# Altium project SPNEX_Payload.PrjPcb (part 1 of 3)
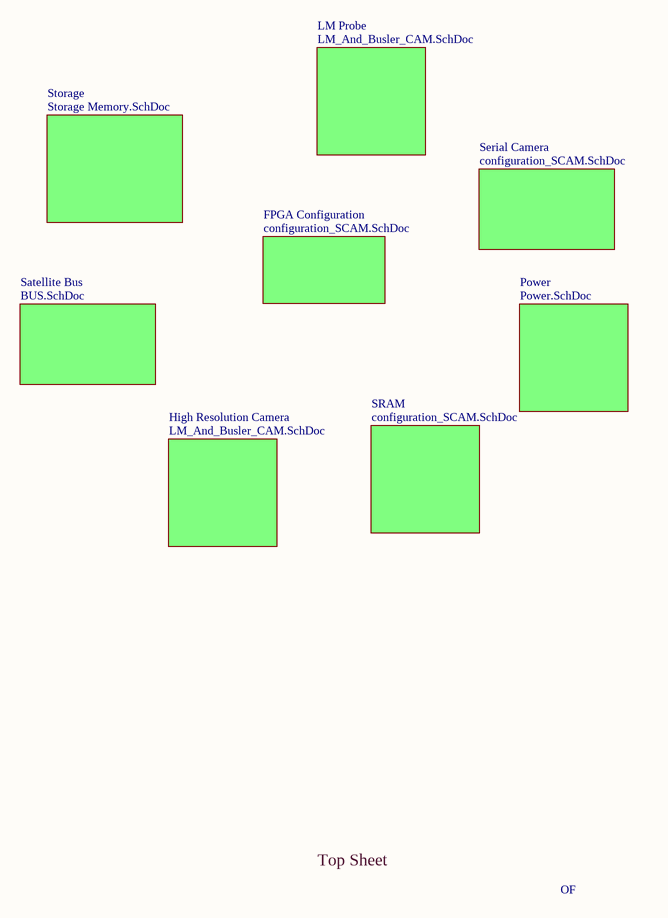
[diagram p0: Topsheet.SchDoc]
myproject: SPNEX  Payload
6 sheets, 308 parts. Net scope: global (net labels, ports and power ports of the same name join across sheets).
Board file: SPNEX_PAYLOAD_new.PcbDoc
Sheets:
  Topsheet.SchDoc
    FPGA Configuration = configuration_SCAM.SchDoc
    Power = Power.SchDoc
    LM Probe = LM_And_Busler_CAM.SchDoc
    Storage = Storage Memory.SchDoc
    Serial Camera = configuration_SCAM.SchDoc
    Satellite Bus = BUS.SchDoc
    High Resolution Camera = LM_And_Busler_CAM.SchDoc
    SRAM = configuration_SCAM.SchDoc

## Sheet Topsheet.SchDoc
size A4; SheetNumber: 1; SheetTotal: 6

### Sub-sheets
FPGA Configuration = configuration_SCAM.SchDoc: no entries
High Resolution Camera = LM_And_Busler_CAM.SchDoc: no entries
LM Probe = LM_And_Busler_CAM.SchDoc: no entries
Power = Power.SchDoc: no entries
Satellite Bus = BUS.SchDoc: no entries
Serial Camera = configuration_SCAM.SchDoc: no entries
SRAM = configuration_SCAM.SchDoc: no entries
Storage = Storage Memory.SchDoc: no entries

### Notes on the sheet
- Top Sheet
- OF

## Sheet configuration_SCAM.SchDoc
size A3; SheetNumber: 4; SheetTotal: 6
Used 3 times, as channels FPGA Configuration, Serial Camera, SRAM. Parts and nets are listed once, with the designators drawn on the sheet.
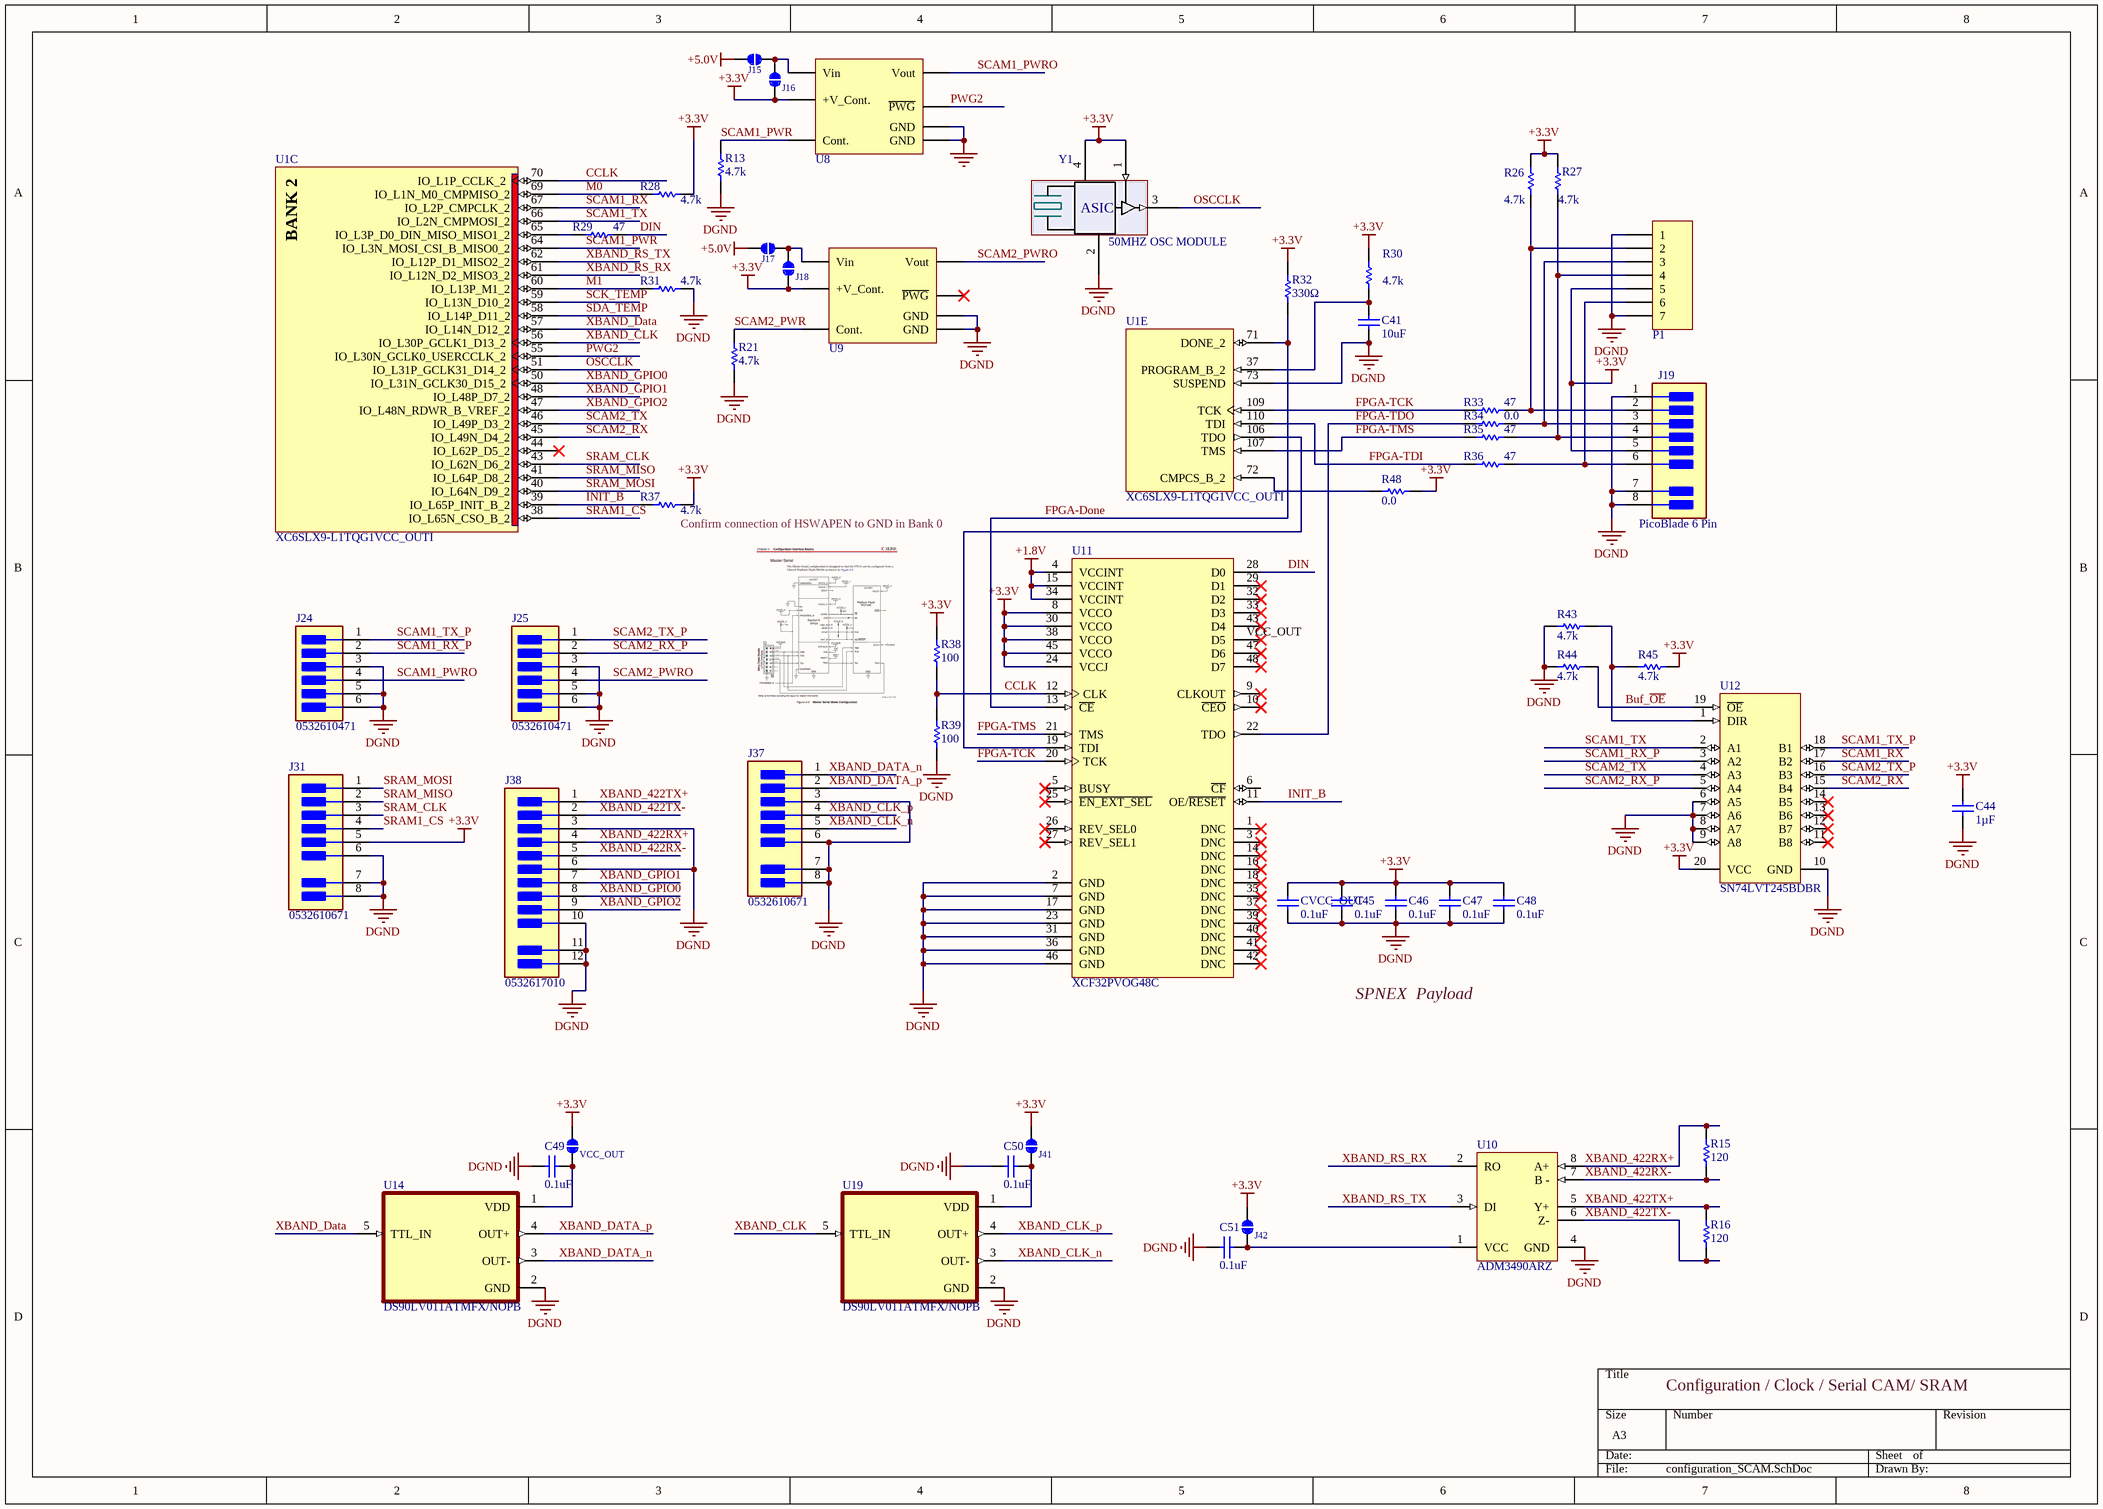
[diagram p1: configuration_SCAM.SchDoc]

### Parts
C41  value 10uF  [capc3216n]  (hidden comment: Cap Semi)
C44  Capacitance: 1µF  [0603CAP]  (hidden comment: Cap_CER_1U_10V_0603)
C45  0.1uF  [0805CAP]
C46  0.1uF  [0805CAP]
C47  0.1uF  [0805CAP]
C48  0.1uF  [0805CAP]
C49  0.1uF  [0805CAP]
C50  value 0.1uF  [0805 - CAP]  (hidden comment: Cap_CER_0.1U_16V_0805)
C51  value 0.1uF  [0805 - CAP]  (hidden comment: Cap_CER_0.1U_16V_0805)
CVCC_OUT  0.1uF  [0805CAP]
J15  JUMPER  [SJMP]  (value not drawn)
J16  JUMPER  [SJMP]  (value not drawn)
J17  JUMPER  [SJMP]  (value not drawn)
J18  JUMPER  [SJMP]  (value not drawn)
J19  PicoBlade 6 Pin  [Molex_6RA_MFG]
J24  0532610471  [Molex_4RA_MFG]
J25  0532610471  [Molex_4RA_MFG]
J31  0532610671  [Molex_6RA_MFG]
J37  0532610671  [Molex_6RA_MFG]
J38  0532617010  [Molex_10RA]
J41  JUMPER  [SJMP]  (value not drawn)
J42  JUMPER  [SJMP]  (value not drawn)
P1  Header 7  [HDR1X7F]  (value not drawn)
R13  Resistance (Ohms): 4.7k  [0603RES]  (hidden comment: RES_4.7K_0.1W_0603)
R15  Resistance (Ohms): 120  [0603RES]  (hidden comment: RES_120_0.25W_0603)
R16  Resistance (Ohms): 120  [0603RES]  (hidden comment: RES_120_0.25W_0603)
R21  Resistance (Ohms): 4.7k  [0603RES]  (hidden comment: RES_4.7K_0.1W_0603)
R26  Resistance (Ohms): 4.7k  [0603RES]  (hidden comment: RES_4.7K_0.1W_0603)
R27  Resistance (Ohms): 4.7k  [0603RES]  (hidden comment: RES_4.7K_0.1W_0603)
R28  Resistance (Ohms): 4.7k  [0603RES]  (hidden comment: RES_4.7K_0.1W_0603)
R29  Resistance (Ohms): 47  [0603RES]  (hidden comment: RES_47R_0.25W_0805)
R30  Resistance (Ohms): 4.7k  [0603RES]  (hidden comment: RES_4.7K_0.1W_0603)
R31  Resistance (Ohms): 4.7k  [0603RES]  (hidden comment: RES_4.7K_0.1W_0603)
R32  Resistance: 330Ω  [0603]  (hidden comment: RES_330 Ohm_0603)
R33  Resistance (Ohms): 47  [0603RES]  (hidden comment: RES_47R_0.25W_0805)
R34  Resistance (Ohms): 0.0  [0603RES]  (hidden comment: RES_0_0.1W_0603)
R35  Resistance (Ohms): 47  [0603RES]  (hidden comment: RES_47R_0.25W_0805)
R36  Resistance (Ohms): 47  [0603RES]  (hidden comment: RES_47R_0.25W_0805)
R37  Resistance (Ohms): 4.7k  [0603RES]  (hidden comment: RES_4.7K_0.1W_0603)
R38  Resistance (Ohms): 100  [0603RES]  (hidden comment: RES_100_0.1W_0603)
R39  Resistance (Ohms): 100  [0603RES]  (hidden comment: RES_100_0.1W_0603)
R43  Resistance (Ohms): 4.7k  [0603RES]  (hidden comment: RES_4.7K_0.1W_0603)
R44  Resistance (Ohms): 4.7k  [0603RES]  (hidden comment: RES_4.7K_0.1W_0603)
R45  Resistance (Ohms): 4.7k  [0603RES]  (hidden comment: RES_4.7K_0.1W_0603)
R48  Resistance (Ohms): 0.0  [0603RES]  (hidden comment: RES_0_0.1W_0603)
U1  XC6SLX9-L1TQG1VCC_OUTI  [TQG144_M]  (parts C,E of 7)
U8  LTC3461 module  [OCPfootprint]  (value not drawn)
U9  LTC3461 module  [OCPfootprint]  (value not drawn)
U10  ADM3490ARZ  [Soic8_IPCA]
U11  XCF32PVOG48C  [VOG48]
U12  SN74LVT245BDBR  [DB0020A_M]
U14  DS90LV011ATMFX/NOPB  [SOT95P280X145-5N]
U19  DS90LV011ATMFX/NOPB  [SOT95P280X145-5N]
VCC_OUT  JUMPER  [SJMP]  (value not drawn)
Y1  50MHZ OSC MODULE  [OscModule]

### Nets
+1.8V: U11.4(VCCINT) U11.15(VCCINT) U11.34(VCCINT)
+3.3V: C44.2 C45.2 C46.2 C47.2 C48.2 CVCC_OUT.2 J16.1 J18.1 J19.5 J31.5 J41.2 J42.2 P1.5 R26.2 R27.2 R28.1 R30.2 R32.2 R37.1 R38.2 R45.1 R48.2 U8.5(+V_Cont.) U9.5(+V_Cont.) U11.8(VCCO) U11.24(VCCJ) U11.30(VCCO) U11.38(VCCO) U11.45(VCCO) U12.20(VCC) VCC_OUT.2 Y1.1(E/D) Y1.4(VDD)
+5.0V: J15.2 J17.2
DGND: C41.1 C44.1 C45.1 C46.1 C47.1 C48.1 C49.2 C50.1 C51.1 CVCC_OUT.1 J19.1 J19.7 J19.8 J24.3 J24.5 J24.6 J25.3 J25.5 J25.6 J31.6 J31.7 J31.8 J37.3 J37.6 J37.7 J37.8 J38.3 J38.6 J38.10 J38.11 J38.12 P1.1 P1.7 R13.2 R21.2 R31.1 R39.1 R43.2 R44.2 U1.73(SUSPEND) U8.2(GND) U8.4(GND) U9.2(GND) U9.4(GND) U10.4(GND) U11.2(GND) U11.7(GND) U11.17(GND) U11.23(GND) U11.31(GND) U11.36(GND) U11.46(GND) U12.6(A5) U12.7(A6) U12.8(A7) U12.9(A8) U12.10(GND) U14.2(GND) U19.2(GND) Y1.2(GND)
Buf_~{OE}: R44.1 U12.19(~{OE})
CCLK: R38.1 R39.2 U1.70(IO_L1P_CCLK_2) U11.12(CLK)
DIN: R29.2 U11.28(D0)
FPGA-Done: R32.1 U1.71(DONE_2) U11.13(~{CE})
FPGA-TCK: R33.1 U1.109(TCK) U11.20(TCK)
FPGA-TDI: R36.1 U1.110(TDI)
FPGA-TDO: R34.1 U11.22(TDO)
FPGA-TMS: R35.1 U1.107(TMS) U11.21(TMS)
INIT_B: R37.2 U1.39(IO_L65P_INIT_B_2) U11.11(OE/~{RESET})
M0: R28.2 U1.69(IO_L1N_M0_CMPMISO_2)
M1: R31.2 U1.60(IO_L13P_M1_2)
OSCCLK: U1.51(IO_L31P_GCLK31_D14_2) Y1.3(Output)
PWG2: U1.55(IO_L30N_GCLK0_USERCCLK_2) U8.7(~{PWG})
SCAM1_PWR: R13.1 U1.64(IO_L3N_MOSI_CSI_B_MISO0_2) U8.6(Cont.)
SCAM1_PWRO: J24.4 U8.3(Vout)
SCAM1_RX: U1.67(IO_L2P_CMPCLK_2) U12.17(B2)
SCAM1_RX_P: J24.2 U12.3(A2)
SCAM1_TX: U1.66(IO_L2N_CMPMOSI_2) U12.2(A1)
SCAM1_TX_P: J24.1 U12.18(B1)
SCAM2_PWR: R21.1 U9.6(Cont.)
SCAM2_PWRO: J25.4 U9.3(Vout)
SCAM2_RX: U1.45(IO_L49N_D4_2) U12.15(B4)
SCAM2_RX_P: J25.2 U12.5(A4)
SCAM2_TX: U1.46(IO_L49P_D3_2) U12.4(A3)
SCAM2_TX_P: J25.1 U12.16(B3)
SCK_TEMP: U1.59(IO_L13N_D10_2)
SDA_TEMP: U1.58(IO_L14P_D11_2)
SRAM1_CS: J31.4 U1.38(IO_L65N_CSO_B_2)
SRAM_CLK: J31.3 U1.43(IO_L62N_D6_2)
SRAM_MISO: J31.2 U1.41(IO_L64P_D8_2)
SRAM_MOSI: J31.1 U1.40(IO_L64N_D9_2)
XBAND_422RX+: J38.4 R15.2 U10.8(A+)
XBAND_422RX-: J38.5 R15.1 U10.7(B_-)
XBAND_422TX+: J38.1 R16.2 U10.5(Y+)
XBAND_422TX-: J38.2 R16.1 U10.6(Z-)
XBAND_CLK: U1.56(IO_L30P_GCLK1_D13_2) U19.5(TTL_IN)
XBAND_CLK_n: J37.5 U19.3(OUT-)
XBAND_CLK_p: J37.4 U19.4(OUT+)
XBAND_Data: U1.57(IO_L14N_D12_2) U14.5(TTL_IN)
XBAND_DATA_n: J37.1 U14.3(OUT-)
XBAND_DATA_p: J37.2 U14.4(OUT+)
XBAND_GPIO0: J38.8 U1.50(IO_L31N_GCLK30_D15_2)
XBAND_GPIO1: J38.7 U1.48(IO_L48P_D7_2)
XBAND_GPIO2: J38.9 U1.47(IO_L48N_RDWR_B_VREF_2)
XBAND_RS_RX: U1.61(IO_L12N_D2_MISO3_2) U10.2(RO)
XBAND_RS_TX: U1.62(IO_L12P_D1_MISO2_2) U10.3(DI)
NetC41_2: C41.2 R30.1 U1.37(PROGRAM_B_2)
NetC49_1: C49.1 U14.1(VDD) VCC_OUT.1
NetC50_2: C50.2 J41.1 U19.1(VDD)
NetC51_2: C51.2 J42.1 U10.1(VCC)
NetJ15_1: J15.1 J16.2 U8.1(Vin)
NetJ17_1: J17.1 J18.2 U9.1(Vin)
NetJ19_2: J19.2 P1.2 R26.1 R33.2
NetJ19_3: J19.3 P1.3 R34.2
NetJ19_4: J19.4 P1.4 R27.1 R35.2
NetJ19_6: J19.6 P1.6 R36.2
NetR29_1: R29.1 U1.65(IO_L3P_D0_DIN_MISO_MISO1_2)
NetR43_1: R43.1 R45.2 U12.1(DIR)
NetR48_1: R48.1 U1.72(CMPCS_B_2)
NetU1_106: U1.106(TDO) U11.19(TDI)

Not connected (* = marked no-connect by the designer): U1 44(IO_L62P_D5_2)*; U9 7(~{PWG})*; U11 1(DNC)* 3(DNC)* 5(BUSY)* 6(~{CF}) 9(CLKOUT)* 10(~{CEO})* 14(DNC)* 16(DNC)* 18(DNC)* 25(~{EN_EXT_SEL})* 26(REV_SEL0)* 27(REV_SEL1)* 29(D1)* 32(D2)* 33(D3)* 35(DNC)* 37(DNC)* 39(DNC)* 40(DNC)* 41(DNC)* 42(DNC)* 43(D4)* 47(D6)* 48(D7)* VCC_OUT(D5)*; U12 11(B8)* 12(B7)* 13(B6)* 14(B5)*

### Channels
FPGA Configuration: designators end in _FPGA_Configuration
Serial Camera: designators end in _Serial_Camera
SRAM: designators end in _SRAM

### Notes on the sheet
- (near R37) Confirm connection of HSWAPEN to GND in Bank 0
- Configuration / Clock / Serial CAM/ SRAM
- (in symbol OscillatorModule) ASIC
- (in symbol XC6SLX9-L1TQG144I, part C) BANK 2

### Library data of the parts
C41 = Cap_CER_10U_10V_1206: Capacitor; PackageReference: C0805; PackageDescription: Chip Capacitor; Supplier 1: Digi-Key; Supplier Part Number 1: 587-2596-1-ND
C44 = Cap_CER_1U_10V_0603: Capacitor; Manufacturer: Taiyo Yuden; Manufacturer Part Number: LMK107B7105KA-T; Tolerance: ±10%; Voltage - Rated: 10V; Temperature Coefficient: X7R; Supplier 1: Digi-Key; RoHS: RoHS Compliant; Category: Capacitors; Stock 1: 600713; Pricing 1: 1=0.1, 10=0.042, 25=0.0308, 50=0.023, 100=0.0188, 250=0.01576, 500=0.01344, 1000=0.01056 (USD); Packaging: Cut Tape (CT); Part Status: Active; Operating Temperature: -55°C ~ 125°C; Features: -; Ratings: -; Applications: General Purpose; Mounting Type: Surface Mount, MLCC; Package / Case: 0603 (1608 Metric); Size / Dimension: 0.063" L x 0.031" W (1.60mm x 0.80mm); Height - Seated (Max): -; Thickness (Max): 0.035" (0.90mm); Lead Spacing: -; Lead Style: -; ComponentLink1URL: http://ds.yuden.co.jp/TYCOMPAS/ut/detail.do?productNo=LMK107B7105KA-T&fileName=LMK107B7105KA-T_SS&mode=specSheetDownload; ComponentLink1Description: http://ds.yuden.co.jp/TYCOMPAS/ut/detail.do?productNo=LMK107B7105KA-T&fileName=LMK107B7105KA-T_SS&mode=specSheetDownload; Supplier Part Number 1: 587-1242-1-ND
C45-C49 CVCC_OUT = CAP_CER_0.1uf_10V_0805: Surface Mount Ceramic Multilayer Capacitor 0.1uF 10% X7R 16V 0805 Paper T/R; Manufacturer: Yageo; Manufacturer Part Number: CC0805KRX7R7BB104; Capacitance: 100nF; Insulation Resistance: 100GR; Supplier 1: Digi-Key; RoHS: Yes; Category: Ceramic Capacitors; Pricing 1: 1=0.12000, 10=0.08400, 50=0.04760, 100=0.03950, 500=0.02768, 1000=0.02291 (USD); Mount: Surface Mount; Case/Package: 0805; Number of Pins: 2; Case Code (Metric): 2012; Case Code (Imperial): 0805; Min Operating Temperature: -55°C; Max Operating Temperature: 125°C; Tolerance: 10%; Voltage Rating: 16V; Voltage Rating (DC): 16V; Packaging: Tape and Reel; Package Quantity: 1; Dielectric: X7R; Termination: SMD/SMT; Resistor Type: Ceramic; Voltage: 16V; Series: CC; Length: 2mm; Width: 0.049inch; Height: 0.85mm; Thickness: 0.033inch; Depth: 1.25mm; Radiation Hardening: No; REACH SVHC: No SVHC; Lead Free: Lead Free; Halogen Free: Halogen Free; RoHS Compliant: Yes; ComponentLink1URL: https://datasheet.ciiva.com/8034/1784427-8034017.pdf?src-supplier=Element14; ComponentLink1Description: https://datasheet.ciiva.com/8034/1784427-8034017.pdf?src-supplier=Element14; ComponentLink2URL: https://datasheet.ciiva.com/11786/0900766b80d84f1d-11786102.pdf?src-supplier=RSComponents; ComponentLink2Description: https://datasheet.ciiva.com/11786/0900766b80d84f1d-11786102.pdf?src-supplier=RSComponents; ComponentLink3URL: https://datasheet.ciiva.com/7978/1489800-7978204.pdf?src-supplier=Element14; ComponentLink3Description: https://datasheet.ciiva.com/7978/1489800-7978204.pdf?src-supplier=Element14; ComponentLink4URL: https://datasheet.ciiva.com/144/mlccorderingcode-144999.pdf?src-supplier=Digi-Key; ComponentLink4Description: https://datasheet.ciiva.com/144/mlccorderingcode-144999.pdf?src-supplier=Digi-Key; ComponentLink5URL: https://datasheet.ciiva.com/144/mlccorderingcode-144998.pdf?src-supplier=Digi-Key; ComponentLink5Description: https://datasheet.ciiva.com/144/mlccorderingcode-144998.pdf?src-supplier=Digi-Key; ComponentLink6URL: https://datasheet.ciiva.com/145/mlccorderingcode-145000.pdf?src-supplier=Digi-Key; ComponentLink6Description: https://datasheet.ciiva.com/145/mlccorderingcode-145000.pdf?src-supplier=Digi-Key; ComponentLink7URL: https://datasheet.ciiva.com/8034/1784427-8034015.pdf?src-supplier=Element14; ComponentLink7Description: https://datasheet.ciiva.com/8034/1784427-8034015.pdf?src-supplier=Element14; ComponentLink8URL: https://datasheet.ciiva.com/11465/upy-gphc-x7r-6-3v-to-50v-8-11465289.pdf?src-supplier=Avnet; ComponentLink8Description: https://datasheet.ciiva.com/11465/upy-gphc-x7r-6-3v-to-50v-8-11465289.pdf?src-supplier=Avnet; ComponentLink9URL: https://datasheet.ciiva.com/15189/getdatasheetpartid-314877-15189221.pdf?src-supplier=Verical; ComponentLink9Description: https://datasheet.ciiva.com/15189/getdatasheetpartid-314877-15189221.pdf?src-supplier=Verical; Supplier Part Number 1: 311-1142-1-ND
C50 C51 = Cap_CER_0.1U_16V_0805: CAP CER 0.1UF 16V X7R 0805; Manufacturer: Samsung Electro-Mechanics America, Inc.; Manufacturer Part Number: CL21B104KOANNNC; Tolerance: ±10%; Capacitance: 0.10µF; Supplier 1: Digi-Key; RoHS: RoHS Compliant; Category: Capacitors; Stock 1: 126841; Pricing 1: 1=0.1, 10=0.033, 25=0.024, 50=0.018, 100=0.0147, 250=0.01232, 500=0.0105, 1000=0.00825 (USD); Packaging: Digi-Reel®; Part Status: Active; Voltage - Rated: 16V; Temperature Coefficient: X7R; Operating Temperature: -55°C ~ 125°C; Features: -; Ratings: -; Applications: General Purpose; Mounting Type: Surface Mount, MLCC; Package / Case: 0805 (2012 Metric); Size / Dimension: 0.079" L x 0.049" W (2.00mm x 1.25mm); Height - Seated (Max): -; Thickness (Max): 0.030" (0.75mm); Lead Spacing: -; Lead Style: -; ComponentLink1URL: http://www.samsungsem.com/kr/support/product-search/mlcc/__icsFiles/afieldfile/2016/08/18/S_CL21B104KOANNNC.pdf; ComponentLink1Description: http://www.samsungsem.com/kr/support/product-search/mlcc/__icsFiles/afieldfile/2016/08/18/S_CL21B104KOANNNC.pdf; Supplier Part Number 1: 1276-2448-6-ND
J15-J18 J41 J42 VCC_OUT = JUMPER: OPTION SELECTION PAD; Supplier 1: Digi-Key
J19 J31 J37 = 0532610671: 1.25mm (.049") Pitch PicoBlade Header, Surface Mount, Right Angle, Lead-free, 6 Circuits; Manufacturer: Molex; Supplier 1: Digi-Key; Manufacturer Part Number: 0532610671; RoHS: Yes; Category: Headers and Wire Housings; Stock 1: 61257; Pricing 1: 1=0.77000, 10=0.63900, 100=0.53240 (USD); ComponentLink1URL: https://datasheet.ciiva.com/6813/532610671-sd-6813952.pdf?src-supplier=Digi-Key; ComponentLink1Description: https://datasheet.ciiva.com/6813/532610671-sd-6813952.pdf?src-supplier=Digi-Key; ComponentLink2URL: https://datasheet.ciiva.com/3933/353410532610671-pcb-headers-3933365.pdf?src-supplier=Arrow+Electronics; ComponentLink2Description: https://datasheet.ciiva.com/3933/353410532610671-pcb-headers-3933365.pdf?src-supplier=Arrow+Electronics; ComponentLink3URL: https://datasheet.ciiva.com/48768/0532610671-pcb-headers-48768267.pdf?src-supplier=Avnet; ComponentLink3Description: https://datasheet.ciiva.com/48768/0532610671-pcb-headers-48768267.pdf?src-supplier=Avnet; ComponentLink4URL: https://datasheet.ciiva.com/6813/532610671-sd-6813947.pdf?src-supplier=Digi-Key; ComponentLink4Description: https://datasheet.ciiva.com/6813/532610671-sd-6813947.pdf?src-supplier=Digi-Key; ComponentLink5URL: https://datasheet.ciiva.com/6813/532610671-sd-6813942.pdf?src-supplier=Digi-Key; ComponentLink5Description: https://datasheet.ciiva.com/6813/532610671-sd-6813942.pdf?src-supplier=Digi-Key; Supplier Part Number 1: WM7624CT-ND
J24 J25 = 0532610471: Conn Shrouded Header (4 Sides) HDR 4 POS 1.25mm Solder RA Side Entry SMD PicoBlade™ T/R; Manufacturer: Molex; Manufacturer Part Number: 53261-0471; Supplier 1: Digi-Key; RoHS: Yes; Category: Headers and Wire Housings; Stock 1: 197190; Pricing 1: 1=0.78000, 10=0.64700, 100=0.53880 (USD); ComponentLink1URL: https://datasheet.ciiva.com/48768/0532610471-pcb-headers-48768287.pdf?src-supplier=Avnet; ComponentLink1Description: https://datasheet.ciiva.com/48768/0532610471-pcb-headers-48768287.pdf?src-supplier=Avnet; Supplier Part Number 1: WM7622CT-ND
J38 = 0532617010: 1.25mm Pitch, PicoBlade PCB Header, Single Row, Right-Angle, Surface Mount, Gold (Au) Plating, Friction Lock, 10...; Manufacturer: Molex; Supplier 1: Digi-Key; Manufacturer Part Number: 0532617010; RoHS: Yes; Category: Connectors; Stock 1: 143; Pricing 1: 1=2.17000, 10=1.85000, 100=1.52820 (USD); Supplier Part Number 1: 900-0532617010CT-ND
P1 = Header 7: Header, 7-Pin; LatestRevisionDate: 17-Jul-2002; LatestRevisionNote: Re-released for DXP Platform.; Publisher: Altium Limited
R13 R21 R26-R28 R30 R31 R37 R43-R45 = RES_4.7K_0.1W_0603: Resistor; Manufacturer: Stackpole Electronics Inc.; Manufacturer Part Number: RMCF0603JT4K70; Tolerance: ±5%; Power (Watts): 0.1W, 1/10W; Temperature Coefficient: ±200ppm/°C; Supplier 1: Digi-Key; RoHS: RoHS Compliant; Category: Resistors; Stock 1: 86000; Pricing 1: 1=0.1, 10=0.012, 25=0.0088, 50=0.0066, 100=0.0049, 250=0.00372, 500=0.00298, 1000=0.0022 (USD); Packaging: Cut Tape (CT); Part Status: Active; Composition: Thick Film; Features: Automotive AEC-Q200; Operating Temperature: -55°C ~ 155°C; Package / Case: 0603 (1608 Metric); Supplier Device Package: 0603; Size / Dimension: 0.061" L x 0.031" W (1.55mm x 0.80mm); Height - Seated (Max): 0.022" (0.55mm); Number of Terminations: 2; Failure Rate: -; ComponentLink1URL: https://www.seielect.com/Catalog/SEI-RMCF_RMCP.pdf; ComponentLink1Description: https://www.seielect.com/Catalog/SEI-RMCF_RMCP.pdf; Supplier Part Number 1: RMCF0603JT4K70CT-ND
R15 R16 = RES_120_0.25W_0603: RES SMD 120 OHM 5% 1/4W 0603; Manufacturer: Rohm Semiconductor; Manufacturer Part Number: ESR03EZPJ121; Power (Watts): 0.25W, 1/4W; Temperature Coefficient: ±200ppm/°C; Supplier 1: Digi-Key; RoHS: RoHS Compliant; Category: Resistors; Stock 1: 32826; Pricing 1: 1=0.1, 10=0.079, 25=0.0544, 50=0.0424, 100=0.0303, 250=0.0236, 500=0.01876, 1000=0.01331 (USD); Packaging: Digi-Reel®; Part Status: Active; Tolerance: ±5%; Composition: Thick Film; Features: Automotive AEC-Q200, Pulse Withstanding; Operating Temperature: -55°C ~ 155°C; Package / Case: 0603 (1608 Metric); Supplier Device Package: 0603; Size / Dimension: 0.063" L x 0.031" W (1.60mm x 0.80mm); Height - Seated (Max): 0.022" (0.55mm); Number of Terminations: 2; Failure Rate: -; ComponentLink1URL: http://rohmfs.rohm.com/en/products/databook/datasheet/passive/resistor/chip_resistor/esr.pdf; ComponentLink1Description: http://rohmfs.rohm.com/en/products/databook/datasheet/passive/resistor/chip_resistor/esr.pdf; Supplier Part Number 1: RHM120DDKR-ND
R29 R33 R35 R36 = RES_47R_0.25W_0805: RES SMD 47 OHM 5% 0.4W 0805; Manufacturer: Rohm Semiconductor; Manufacturer Part Number: ESR10EZPJ470; Temperature Coefficient: ±200ppm/°C; Supplier 1: Digi-Key; RoHS: RoHS Compliant; Category: Resistors; Stock 1: 17932; Pricing 1: 1=0.11, 10=0.098, 100=0.0378, 1000=0.01664, 2500=0.01437 (USD); Packaging: Cut Tape (CT); Part Status: Active; Tolerance: ±5%; Power (Watts): 0.4W; Composition: Thick Film; Features: Automotive AEC-Q200, Pulse Withstanding; Operating Temperature: -55°C ~ 155°C; Package / Case: 0805 (2012 Metric); Supplier Device Package: 0805; Size / Dimension: 0.079" L x 0.049" W (2.00mm x 1.25mm); Height - Seated (Max): 0.026" (0.65mm); Failure Rate: -; ComponentLink1URL: http://www.rohm.com/web/global/datasheet/ESR01MZPF/esr-e; ComponentLink1Description: http://www.rohm.com/web/global/datasheet/ESR01MZPF/esr-e; Supplier Part Number 1: RHM47KCT-ND
R32 = RES_330 Ohm_0603: Res Thick Film 0603 330 Ohm 5% 0.1W(1/10W) +/-200ppm/ßC Pad SMD Automotive T/R; Manufacturer: Panasonic; Manufacturer Part Number: ERJ-3GEYJ331V; Power Rating: 100mW; Voltage Rating: 75V; Temperature Coefficient: 200ppm/°C; Voltage Rating (DC): 50V; Supplier 1: Digi-Key; RoHS: Yes; Stock 1: 2750454; Pricing 1: 1 = 0.10000, 10 = 0.05400, 100 = 0.02190, 1000 = 0.00985, 2500 = 0.00855 (USD); Mount: Surface Mount; Case/Package: 0603; Weight: 7.1E-05oz; Case Code (Metric): 1608; Case Code (Imperial): 0603; Contact Plating: Tin; Min Operating Temperature: -55°C; Max Operating Temperature: 155°C; Tolerance: 5%; Packaging: Tape and Reel; Package Quantity: 1; Composition: Thick Film; Number of Terminations: 2; Termination: SMD/SMT; Military Standard: Not; Max Power Dissipation: 100mW; Features: Automotive AEC-Q200; Length: 1.6mm; Height: 0.45mm; Width: 0.031inch; Depth: 0.8mm; Radiation Hardening: No; REACH SVHC: No SVHC; Lead Free: Lead Free; ComponentLink1URL: https://datasheet.ciiva.com/34303/1988727-34303616.pdf?src-supplier=Jameco; ComponentLink1Description: https://datasheet.ciiva.com/34303/1988727-34303616.pdf?src-supplier=Jameco; ComponentLink2URL: https://datasheet.ciiva.com/11821/0900766b80f806dd-11821444.pdf?src-supplier=RSComponents; ComponentLink2Description: https://datasheet.ciiva.com/11821/0900766b80f806dd-11821444.pdf?src-supplier=RSComponents; ComponentLink3URL: https://datasheet.ciiva.com/9117/aoa0000ce1-9117173.pdf?src-supplier=Avnet; ComponentLink3Description: https://datasheet.ciiva.com/9117/aoa0000ce1-9117173.pdf?src-supplier=Avnet; ComponentLink4URL: https://datasheet.ciiva.com/16767/70255313-16767749.pdf?src-supplier=Allied+Electronics; ComponentLink4Description: https://datasheet.ciiva.com/16767/70255313-16767749.pdf?src-supplier=Allied+Electronics; ComponentLink5URL: https://datasheet.ciiva.com/15159/getdatasheetpartid-29203-15159270.pdf?src-supplier=Verical; ComponentLink5Description: https://datasheet.ciiva.com/15159/getdatasheetpartid-29203-15159270.pdf?src-supplier=Verical; ComponentLink6URL: https://datasheet.ciiva.com/28673/1678796-28673994.pdf?src-supplier=Element14; ComponentLink6Description: https://datasheet.ciiva.com/28673/1678796-28673994.pdf?src-supplier=Element14; ComponentLink7URL: https://datasheet.ciiva.com/6138/1500035-6138716.pdf?src-supplier=Farnell; ComponentLink7Description: https://datasheet.ciiva.com/6138/1500035-6138716.pdf?src-supplier=Farnell; ComponentLink8URL: https://datasheet.ciiva.com/46381/1500035-46381164.pdf?src-supplier=Element14; ComponentLink8Description: https://datasheet.ciiva.com/46381/1500035-46381164.pdf?src-supplier=Element14; ComponentLink9URL: https://datasheet.ciiva.com/16449/aoa0000ce1-16449005.pdf?src-supplier=Future+Electronics; ComponentLink9Description: https://datasheet.ciiva.com/16449/aoa0000ce1-16449005.pdf?src-supplier=Future+Electronics; Supplier Part Number 1: P330GCT-ND
R34 R48 = RES_0_0.1W_0603: Resistor; Manufacturer: Samsung Electro-Mechanics America, Inc.; Manufacturer Part Number: RC1608J000CS; Tolerance: Jumper; Power (Watts): 0.1W, 1/10W; Supplier 1: Digi-Key; RoHS: RoHS Compliant; Category: Resistors; Stock 1: 498586; Pricing 1: 1=0.1, 10=0.017, 25=0.0124, 50=0.0094, 100=0.0069, 250=0.00528, 500=0.00422, 1000=0.0031 (USD); Packaging: Cut Tape (CT); Part Status: Active; Composition: Thick Film; Features: Moisture Resistant; Temperature Coefficient: -; Operating Temperature: -55°C ~ 155°C; Package / Case: 0603 (1608 Metric); Supplier Device Package: 0603; Size / Dimension: 0.063" L x 0.031" W (1.60mm x 0.80mm); Height - Seated (Max): 0.022" (0.55mm); Number of Terminations: 2; Failure Rate: -; ComponentLink1URL: http://media.digikey.com/pdf/Data%20Sheets/Samsung%20PDFs/RC_Series_ds.pdf; ComponentLink1Description: http://media.digikey.com/pdf/Data%20Sheets/Samsung%20PDFs/RC_Series_ds.pdf; Supplier Part Number 1: 1276-3510-1-ND
R38 R39 = RES_100_0.1W_0603: Resistor; Manufacturer: Stackpole Electronics Inc.; Manufacturer Part Number: RMCF0603JT100R; Tolerance: ±5%; Power (Watts): 0.1W, 1/10W; Temperature Coefficient: ±200ppm/°C; Supplier 1: Digi-Key; RoHS: RoHS Compliant; Category: Resistors; Stock 1: 154958; Pricing 1: 1=0.1, 10=0.012, 25=0.0088, 50=0.0066, 100=0.0049, 250=0.00372, 500=0.00298, 1000=0.0022 (USD); Packaging: Cut Tape (CT); Part Status: Active; Composition: Thick Film; Features: Automotive AEC-Q200; Operating Temperature: -55°C ~ 155°C; Package / Case: 0603 (1608 Metric); Supplier Device Package: 0603; Size / Dimension: 0.061" L x 0.031" W (1.55mm x 0.80mm); Height - Seated (Max): 0.022" (0.55mm); Number of Terminations: 2; Failure Rate: -; ComponentLink1URL: https://www.seielect.com/Catalog/SEI-RMCF_RMCP.pdf; ComponentLink1Description: https://www.seielect.com/Catalog/SEI-RMCF_RMCP.pdf; Supplier Part Number 1: RMCF0603JT100RCT-ND
U1 = XC6SLX9-L1TQG144I: Spartan-6 LX 1.0V FPGA, 102 User I/Os, 144-Pin TQFP (0.5mm Pitch), Low Power Version, Industrial Grade, Pb-Free; Published: 17-Nov-2009; DatasheetVersion: ver1.6, Nov-2010; PackageVersion: ver1.2, Jun-2004; PackageReference: TQG144; Publisher: Altium Limited; PackageDescription: 144-Pin Thin Quad Flat Pack (TQG144) - Pb-Free; Code_JEDEC: MS-026-BFB; ComponentLink1Description: Manufacturer Link; ComponentLink1URL: http://www.xilinx.com; ComponentLink2Description: Spartan-6 Datasheet; ComponentLink2URL: http://www.xilinx.com/support/documentation/data_sheets/ds160.pdf; ComponentLink3Description: Spartan-6 Documents; ComponentLink3URL: http://www.xilinx.com/support/documentation/spartan-6.htm; ComponentLink4Description: Xilinx.com Home; ComponentLink4URL: http://www.xilinx.com; Supplier 1: Digi-Key; Supplier Part Number 1: 122-1779-ND
U8 U9 = OCP_Module
U10 = ADM3490ARZ: Single Transmitter/Receiver RS-422/RS-485 8-Pin SOIC N T/R; Manufacturer: Analog Devices; Manufacturer Part Number: ADM3490ARZ-REEL7; Nominal Supply Current: 2.2mA; Data Rate: 10Mbps; Number of Receivers: 1; Max Supply Voltage: 3.6V; Min Supply Voltage: 3V; Operating Supply Voltage: 3.3V; Simplex/Duplex: Full Duplex; Receiver Hysteresis: 50mV; ESD Protection: No; Supplier 1: Digi-Key; RoHS: Yes; Category: RS-232 / RS-422 / RS-485 Interface ICs; Stock 1: 3238; Pricing 1: 1=3.37000, 10=3.02700, 25=2.86200, 100=2.48040, 250=2.35320, 500=2.11152 (USD); Case/Package: SOIC N; Number of Pins: 8; Weight: 0.019048oz; Contact Plating: Tin,Matte; Min Operating Temperature: -40°C; Max Operating Temperature: 85°C; Packaging: Tape and Reel; Package Quantity: 1000; Number of Transmitters: 1; Logic Function: Receiver; Number of Drivers: 1; Operating Supply Current: 2.2mA; Number of Transceivers: 1; Max Supply Current: 2.2mA; Series: -; Supply Current: 2.2mA; Radiation Hardening: No; Lead Free: Contains Lead; RoHS Compliant: Yes; ComponentLink1URL: https://datasheet.ciiva.com/3028/adm3483-3485-3488-3490-3491-3028986.pdf?src-supplier=Avnet; ComponentLink1Description: https://datasheet.ciiva.com/3028/adm3483-3485-3488-3490-3491-3028986.pdf?src-supplier=Avnet; Supplier Part Number 1: ADM3490ARZ-REEL7CT-ND
U11 = XCF32PVOG48C: XCF00P Series, Platform Flash In-System Programmable Configuration 1.8V PROM, 48-Pin TSSOP, 32-Megabit, Commercial Grade, Pb-Free; Manufacturer: Xilinx Inc.; Programmable Type: In System Programmable; Memory Size: 32Mb; Voltage - Supply: 1.65 V ~ 2 V; Supplier 1: Digi-Key; Manufacturer Part Number: XCF32PVOG48C; RoHS: RoHS Compliant; Category: Integrated Circuits (ICs); Stock 1: 1060; Pricing 1: 1=27.23 (USD); Packaging: Tube; Part Status: Active; Operating Temperature: -40°C ~ 85°C; Package / Case: 48-TFSOP (0.724", 18.40mm Width); Supplier Device Package: 48-TSOP; ComponentLink1URL: http://www.xilinx.com/support/documentation/data_sheets/ds123.pdf; ComponentLink1Description: http://www.xilinx.com/support/documentation/data_sheets/ds123.pdf; Supplier Part Number 1: 122-1458-ND
U12 = SN74LVT245BDBR: 3.3-V ABT Octal Bus Transceivers With 3-State Outputs, DB0020A, LARGE T&R; Manufacturer: Texas Instruments; Technology Family: LVT; VCC(Min)(V): 2.7; Input Type: TTL/CMOS; Output Type: LVTTL; F @ Nom Voltage(Max)(Mhz): 160; VCC(Max)(V): 3.6; ICC @ Nom Voltage(Max)(mA): 5; Output Drive (IOL/IOH)(Max)(mA): -32/64; Schmitt Trigger: No; Rating: Catalog; tpd @ Nom Voltage(Max)(ns): 3.5; Bits(#): 8; Voltage(Nom)(V): 3.3; Operating Temperature Range(C): -40 to 85; PartNumber: SN74LVT245BDBR; ComponentLink1Description: Manufacturer URL; ComponentLink2Description: Datasheet; DatasheetVersion: SCES004H; ComponentLink3URL: http://www.ti.com/lit/ml/mpds508/mpds508.pdf; ComponentLink1URL: http://www.ti.com/; Code_JEDEC: MO-150; ComponentLink2URL: http://www.ti.com/lit/ds/symlink/sn74lvt245b.pdf; PackageReference: DB0020A; ComponentLink3Description: Package Specification; Generic Part Number: SN74LVT245B; Supplier 1: Digi-Key; Supplier Part Number 1: 296-8650-1-ND
Y1 = OscillatorModule: Supplier 1: Digi-Key; Supplier Part Number 1: XC1892CT-ND
U14 U19 = DS90LV011ATMFX/NOPB: Package: None; Price: None; Value: *; MP: DS90LV011ATMFX/NOPB; Availability: Unavailable

## Sheet Power.SchDoc
size A4; Author: Khaled Shahin; SheetNumber: 2; SheetTotal: 6
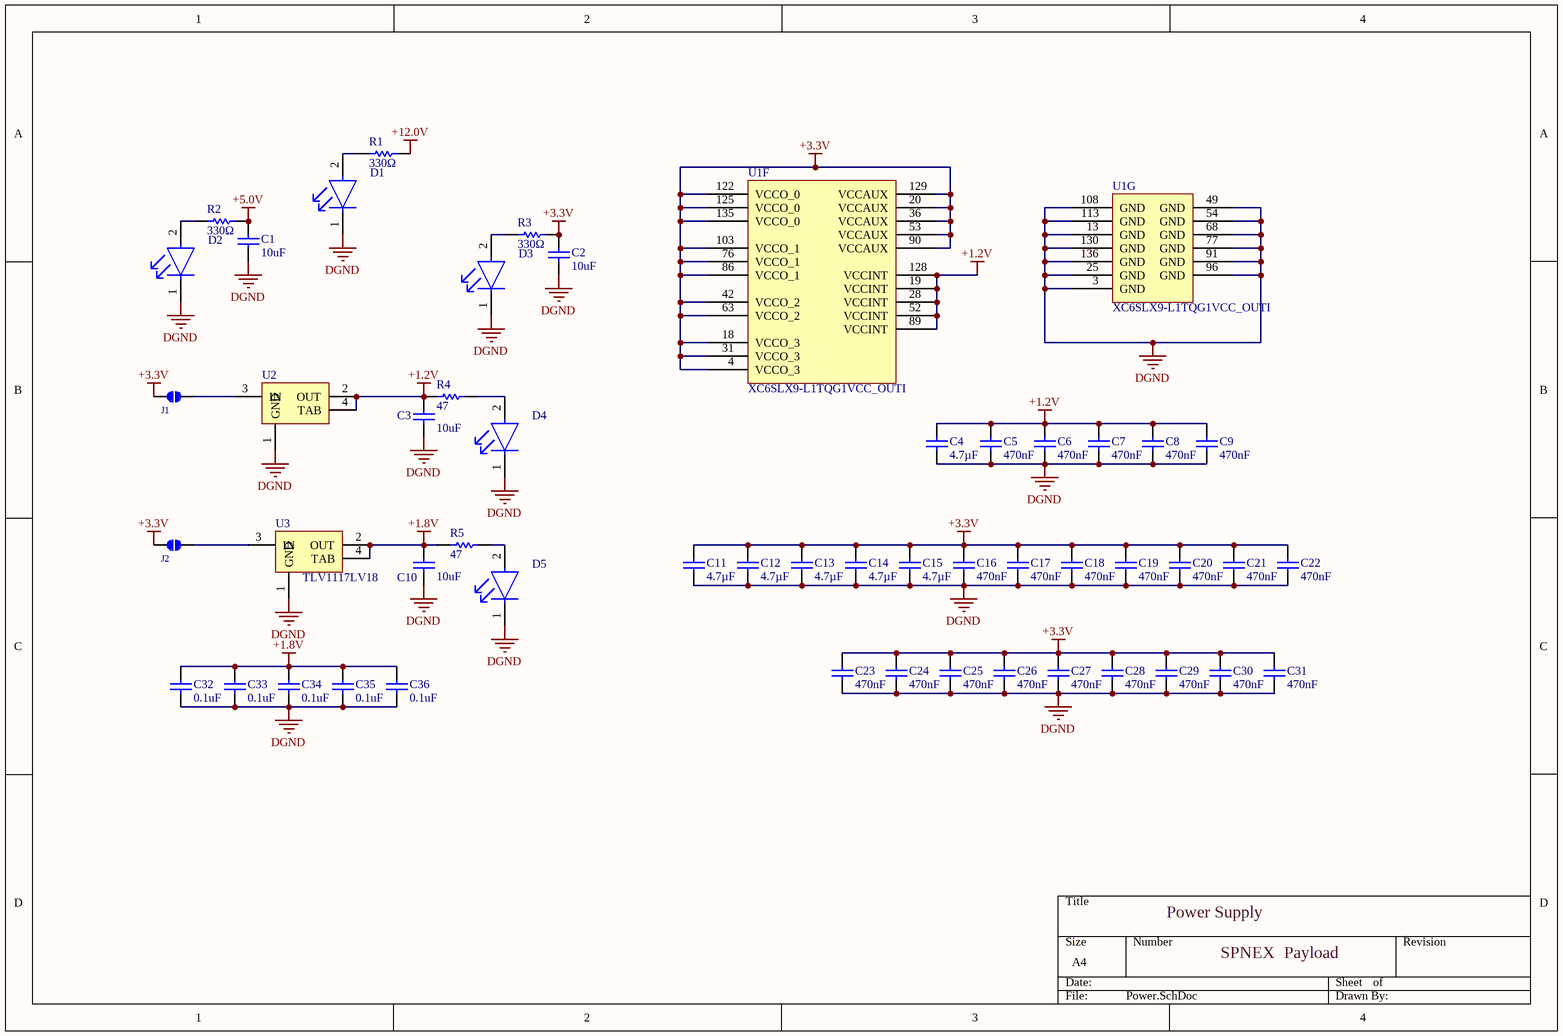
[diagram p2: Power.SchDoc]

### Parts
C1  value 10uF  [capc3216n]  (hidden comment: Cap Semi)
C2  value 10uF  [capc3216n]  (hidden comment: Cap Semi)
C3  value 10uF  [capc3216n]  (hidden comment: Cap Semi)
C4  Capacitance: 4.7µF  [0805CAP]  (hidden comment: Cap_CER_4.7U_25V_0805)
C5  Capacitance: 470nF  [0603CAP]  (hidden comment: CAP CER 0.47UF 10V X7R 0603)
C6  Capacitance: 470nF  [0603CAP]  (hidden comment: CAP CER 0.47UF 10V X7R 0603)
C7  Capacitance: 470nF  [0603CAP]  (hidden comment: CAP CER 0.47UF 10V X7R 0603)
C8  Capacitance: 470nF  [0603CAP]  (hidden comment: CAP CER 0.47UF 10V X7R 0603)
C9  Capacitance: 470nF  [0603CAP]  (hidden comment: CAP CER 0.47UF 10V X7R 0603)
C10  value 10uF  [capc3216n]  (hidden comment: Cap Semi)
C11  Capacitance: 4.7µF  [0805CAP]  (hidden comment: Cap_CER_4.7U_25V_0805)
C12  Capacitance: 4.7µF  [0805CAP]  (hidden comment: Cap_CER_4.7U_25V_0805)
C13  Capacitance: 4.7µF  [0805CAP]  (hidden comment: Cap_CER_4.7U_25V_0805)
C14  Capacitance: 4.7µF  [0805CAP]  (hidden comment: Cap_CER_4.7U_25V_0805)
C15  Capacitance: 4.7µF  [0805CAP]  (hidden comment: Cap_CER_4.7U_25V_0805)
C16  Capacitance: 470nF  [0603CAP]  (hidden comment: CAP CER 0.47UF 10V X7R 0603)
C17  Capacitance: 470nF  [0603CAP]  (hidden comment: CAP CER 0.47UF 10V X7R 0603)
C18  Capacitance: 470nF  [0603CAP]  (hidden comment: CAP CER 0.47UF 10V X7R 0603)
C19  Capacitance: 470nF  [0603CAP]  (hidden comment: CAP CER 0.47UF 10V X7R 0603)
C20  Capacitance: 470nF  [0603CAP]  (hidden comment: CAP CER 0.47UF 10V X7R 0603)
C21  Capacitance: 470nF  [0603CAP]  (hidden comment: CAP CER 0.47UF 10V X7R 0603)
C22  Capacitance: 470nF  [0603CAP]  (hidden comment: CAP CER 0.47UF 10V X7R 0603)
C23  Capacitance: 470nF  [0603CAP]  (hidden comment: CAP CER 0.47UF 10V X7R 0603)
C24  Capacitance: 470nF  [0603CAP]  (hidden comment: CAP CER 0.47UF 10V X7R 0603)
C25  Capacitance: 470nF  [0603CAP]  (hidden comment: CAP CER 0.47UF 10V X7R 0603)
C26  Capacitance: 470nF  [0603CAP]  (hidden comment: CAP CER 0.47UF 10V X7R 0603)
C27  Capacitance: 470nF  [0603CAP]  (hidden comment: CAP CER 0.47UF 10V X7R 0603)
C28  Capacitance: 470nF  [0603CAP]  (hidden comment: CAP CER 0.47UF 10V X7R 0603)
C29  Capacitance: 470nF  [0603CAP]  (hidden comment: CAP CER 0.47UF 10V X7R 0603)
C30  Capacitance: 470nF  [0603CAP]  (hidden comment: CAP CER 0.47UF 10V X7R 0603)
C31  Capacitance: 470nF  [0603CAP]  (hidden comment: CAP CER 0.47UF 10V X7R 0603)
C32  0.1uF  [0805CAP]
C33  0.1uF  [0805CAP]
C34  0.1uF  [0805CAP]
C35  0.1uF  [0805CAP]
C36  0.1uF  [0805CAP]
D1  LED RED CLEAR 2SMD  [ROHM_SML-21_MFG]  (value not drawn)
D2  LED RED CLEAR 2SMD  [ROHM_SML-21_MFG]  (value not drawn)
D3  LED RED CLEAR 2SMD  [ROHM_SML-21_MFG]  (value not drawn)
D4  LED RED CLEAR 2SMD  [ROHM_SML-21_MFG]  (value not drawn)
D5  LED RED CLEAR 2SMD  [ROHM_SML-21_MFG]  (value not drawn)
J1  JUMPER  [SJMP]  (value not drawn)
J2  JUMPER  [SJMP]  (value not drawn)
R1  Resistance: 330Ω  [0603]  (hidden comment: RES_330 Ohm_0603)
R2  Resistance: 330Ω  [0603]  (hidden comment: RES_330 Ohm_0603)
R3  Resistance: 330Ω  [0603]  (hidden comment: RES_330 Ohm_0603)
R4  Resistance (Ohms): 47  [0603RES]  (hidden comment: RES_47R_0.25W_0805)
R5  Resistance (Ohms): 47  [0603RES]  (hidden comment: RES_47R_0.25W_0805)
U1  XC6SLX9-L1TQG1VCC_OUTI  [TQG144_M]  (parts F,G of 7)
U2  IC REG LINEAR 1.2V 1A SOT223-4  [DCY0004A_M]  (value not drawn)
U3  TLV1117LV18  [DCY0004A_M]

### Nets
+1.2V: C3.2 C4.1 C5.1 C6.1 C7.1 C8.1 C9.1 R4.1 U1.19(VCCINT) U1.28(VCCINT) U1.52(VCCINT) U1.89(VCCINT) U1.128(VCCINT) U2.2(OUT) U2.4(TAB)
+1.8V: C10.2 C32.2 C33.2 C34.2 C35.2 C36.2 R5.1 U3.2(OUT) U3.4(TAB)
+3.3V: C2.2 C11.1 C12.1 C13.1 C14.1 C15.1 C16.1 C17.1 C18.1 C19.1 C20.1 C21.1 C22.1 C23.1 C24.1 C25.1 C26.1 C27.1 C28.1 C29.1 C30.1 C31.1 J1.1 J2.1 R3.2 U1.4(VCCO_3) U1.18(VCCO_3) U1.20(VCCAUX) U1.31(VCCO_3) U1.36(VCCAUX) U1.42(VCCO_2) U1.53(VCCAUX) U1.63(VCCO_2) U1.76(VCCO_1) U1.86(VCCO_1) U1.90(VCCAUX) U1.103(VCCO_1) U1.122(VCCO_0) U1.125(VCCO_0) U1.129(VCCAUX) U1.135(VCCO_0)
+5.0V: C1.2 R2.2
+12.0V: R1.2
DGND: C1.1 C2.1 C3.1 C4.2 C5.2 C6.2 C7.2 C8.2 C9.2 C10.1 C11.2 C12.2 C13.2 C14.2 C15.2 C16.2 C17.2 C18.2 C19.2 C20.2 C21.2 C22.2 C23.2 C24.2 C25.2 C26.2 C27.2 C28.2 C29.2 C30.2 C31.2 C32.1 C33.1 C34.1 C35.1 C36.1 D1.1(C) D2.1(C) D3.1(C) D4.1(C) D5.1(C) U1.3(GND) U1.13(GND) U1.25(GND) U1.49(GND) U1.54(GND) U1.68(GND) U1.77(GND) U1.91(GND) U1.96(GND) U1.108(GND) U1.113(GND) U1.130(GND) U1.136(GND) U2.1(GND) U3.1(GND)
NetD1_2: D1.2(A) R1.1
NetD2_2: D2.2(A) R2.1
NetD3_2: D3.2(A) R3.1
NetD4_2: D4.2(A) R4.2
NetD5_2: D5.2(A) R5.2
NetJ1_2: J1.2 U2.3(IN)
NetJ2_2: J2.2 U3.3(IN)

### Notes on the sheet
- Power Supply

### Library data of the parts
C1-C3 C10 = Cap_CER_10U_10V_1206: Capacitor; PackageReference: C0805; PackageDescription: Chip Capacitor; Supplier 1: Digi-Key; Supplier Part Number 1: 587-2596-1-ND
C4 C11-C15 = Cap_CER_4.7U_25V_0805: CAP CER 4.7UF 25V X7R 0805; Manufacturer: TDK Corporation; Manufacturer Part Number: C2012X7R1E475K125AB; Tolerance: ±10%; Supplier 1: Digi-Key; RoHS: RoHS Compliant; Category: Capacitors; Stock 1: 129176; Pricing 1: 1=0.45, 10=0.392, 100=0.196, 250=0.1568, 500=0.1428, 1000=0.1288 (USD); Packaging: Cut Tape (CT); Part Status: Active; Voltage - Rated: 25V; Temperature Coefficient: X7R; Operating Temperature: -55°C ~ 125°C; Features: Low ESL; Ratings: -; Applications: General Purpose; Failure Rate: -; Mounting Type: Surface Mount, MLCC; Package / Case: 0805 (2012 Metric); Size / Dimension: 0.079" L x 0.049" W (2.00mm x 1.25mm); Height - Seated (Max): -; Thickness (Max): 0.057" (1.45mm); Lead Spacing: -; Lead Style: -; ComponentLink1URL: https://product.tdk.com/info/en/catalog/datasheets/mlcc_commercial_general_en.pdf; ComponentLink1Description: https://product.tdk.com/info/en/catalog/datasheets/mlcc_commercial_general_en.pdf; Supplier Part Number 1: 445-5972-1-ND
C5-C9 C16-C31 = Cap_CER_0.47U_10V_0603: 0.47µF ±10% 10V Ceramic Capacitor X7R 0603 (1608 Metric); Manufacturer: KEMET; Manufacturer Part Number: C0603C474K8RACTU; Dissipation Factor: 5%; ComponentLink1URL: http://ds.yuden.co.jp/TYCOMPAS/ut/detail.do?productNo=LMK107B7105KA-T&fileName=LMK107B7105KA-T_SS&mode=specSheetDownload; ComponentLink1Description: http://ds.yuden.co.jp/TYCOMPAS/ut/detail.do?productNo=LMK107B7105KA-T&fileName=LMK107B7105KA-T_SS&mode=specSheetDownload; Supplier 1: Digi-Key; RoHS: Yes; Stock 1: 60616; Pricing 1: 1 = 0.42000, 10 = 0.29500, 100 = 0.19410, 500 = 0.14376, 1000 = 0.12220 (USD); Mount: Surface Mount,PCB; Case/Package: 0603; Case Code (Metric): 1608; Case Code (Imperial): 0603; Dielectric Material: Ceramic; Min Operating Temperature: -55°C; Max Operating Temperature: 125°C; Tolerance: 10%; Packaging: Tape and Reel; Voltage Rating (DC): 10V; Dielectric: X7R; Package Quantity: 1; Voltage Rating: 10V; Termination: SMD/SMT; Voltage: 10V; Length: 1.6mm; Height: 0.8mm; Width: 0.031inch; Depth: 0.8mm; Thickness: 0.034inch; Lead Pitch: 0.7mm; Radiation Hardening: No; REACH SVHC: No SVHC; ComponentLink2URL: https://datasheet.ciiva.com/18193/getdatasheetpartid-650342-18193126.pdf?src-supplier=Verical; ComponentLink2Description: https://datasheet.ciiva.com/18193/getdatasheetpartid-650342-18193126.pdf?src-supplier=Verical; ComponentLink3URL: https://datasheet.ciiva.com/14595/70095383-14595897.pdf?src-supplier=Allied+Electronics; ComponentLink3Description: https://datasheet.ciiva.com/14595/70095383-14595897.pdf?src-supplier=Allied+Electronics; ComponentLink4URL: https://datasheet.ciiva.com/5418/kem-c1002-x7r-smd-5418063.pdf?src-supplier=Mouser; ComponentLink4Description: https://datasheet.ciiva.com/5418/kem-c1002-x7r-smd-5418063.pdf?src-supplier=Mouser; Supplier Part Number 1: 399-4923-1-ND; Supplier 2: Digi-Key; Supplier Part Number 2: 399-C0603C474K8RAC7867CT-ND
C32-C36 = CAP_CER_0.1uf_10V_0805: as C45 on sheet configuration_SCAM; Supplier 1: Digi-Key; RoHS: Yes; Category: Ceramic Capacitors; Pricing 1: 1=0.12000, 10=0.08400, 50=0.04760, 100=0.03950, 500=0.02768, 1000=0.02291 (USD); Mount: Surface Mount; Case/Package: 0805; Number of Pins: 2; Case Code (Metric): 2012; Case Code (Imperial): 0805; Min Operating Temperature: -55°C; Max Operating Temperature: 125°C; Tolerance: 10%; Voltage Rating: 16V; Voltage Rating (DC): 16V; Packaging: Tape and Reel; Package Quantity: 1; Dielectric: X7R; Termination: SMD/SMT; Resistor Type: Ceramic; Voltage: 16V; Series: CC; Length: 2mm; Width: 0.049inch; Height: 0.85mm; Thickness: 0.033inch; Depth: 1.25mm; Radiation Hardening: No; REACH SVHC: No SVHC; Lead Free: Lead Free; Halogen Free: Halogen Free; RoHS Compliant: Yes; ComponentLink1URL: https://datasheet.ciiva.com/8034/1784427-8034017.pdf?src-supplier=Element14; ComponentLink1Description: https://datasheet.ciiva.com/8034/1784427-8034017.pdf?src-supplier=Element14; ComponentLink2URL: https://datasheet.ciiva.com/11786/0900766b80d84f1d-11786102.pdf?src-supplier=RSComponents; ComponentLink2Description: https://datasheet.ciiva.com/11786/0900766b80d84f1d-11786102.pdf?src-supplier=RSComponents; ComponentLink3URL: https://datasheet.ciiva.com/7978/1489800-7978204.pdf?src-supplier=Element14; ComponentLink3Description: https://datasheet.ciiva.com/7978/1489800-7978204.pdf?src-supplier=Element14; ComponentLink4URL: https://datasheet.ciiva.com/144/mlccorderingcode-144999.pdf?src-supplier=Digi-Key; ComponentLink4Description: https://datasheet.ciiva.com/144/mlccorderingcode-144999.pdf?src-supplier=Digi-Key; ComponentLink5URL: https://datasheet.ciiva.com/144/mlccorderingcode-144998.pdf?src-supplier=Digi-Key; ComponentLink5Description: https://datasheet.ciiva.com/144/mlccorderingcode-144998.pdf?src-supplier=Digi-Key; ComponentLink6URL: https://datasheet.ciiva.com/145/mlccorderingcode-145000.pdf?src-supplier=Digi-Key; ComponentLink6Description: https://datasheet.ciiva.com/145/mlccorderingcode-145000.pdf?src-supplier=Digi-Key; ComponentLink7URL: https://datasheet.ciiva.com/8034/1784427-8034015.pdf?src-supplier=Element14; ComponentLink7Description: https://datasheet.ciiva.com/8034/1784427-8034015.pdf?src-supplier=Element14; ComponentLink8URL: https://datasheet.ciiva.com/11465/upy-gphc-x7r-6-3v-to-50v-8-11465289.pdf?src-supplier=Avnet; ComponentLink8Description: https://datasheet.ciiva.com/11465/upy-gphc-x7r-6-3v-to-50v-8-11465289.pdf?src-supplier=Avnet; ComponentLink9URL: https://datasheet.ciiva.com/15189/getdatasheetpartid-314877-15189221.pdf?src-supplier=Verical; ComponentLink9Description: https://datasheet.ciiva.com/15189/getdatasheetpartid-314877-15189221.pdf?src-supplier=Verical; Supplier Part Number 1: 311-1142-1-ND
D1-D5 = APT2012LSECK/J3-PRV: Red 625nm LED Indication - Discrete 1.8V 0805 (2012 Metric); Manufacturer: Kingbright; Lens Color: Colorless; Luminous Intensity: 40mcd; Test Current: 2mA; Viewing Angle: 120°; Supplier 1: Digi-Key; Manufacturer Part Number: APT2012LSECK/J3-PRV; RoHS: Yes; Category: LEDs; Stock 1: 47256; Pricing 1: 1=0.68000, 10=0.41600, 100=0.23890, 1000=0.18698 (USD); Mount: Surface Mount; Case/Package: 0805; Color: Red; Case Code (Metric): 2012; Case Code (Imperial): 0805; Packaging: Tape and Reel; Lens Transparency: Clear; Dominant Wavelength: 625nm; Forward Voltage: 1.8V; Length: 2mm; Width: 1.25mm; Height: 0.75mm; RoHS Compliant: Yes; ComponentLink1URL: http://www.mouser.com/ds/2/216/APT2012LSECK-J3-PRV-535674.pdf?src-supplier=Mouser; ComponentLink1Description: http://www.mouser.com/ds/2/216/APT2012LSECK-J3-PRV-535674.pdf?src-supplier=Mouser; ComponentLink2URL: http://www.kingbrightusa.com/images/catalog/SPEC/APT2012LSECK-J3-PRV.pdf?src-supplier=Digi-Key; ComponentLink2Description: http://www.kingbrightusa.com/images/catalog/SPEC/APT2012LSECK-J3-PRV.pdf?src-supplier=Digi-Key; Supplier Part Number 1: 754-1935-1-ND
J1 J2 = JUMPER: OPTION SELECTION PAD; Supplier 1: Digi-Key
R1-R3 = RES_330 Ohm_0603: as R32 on sheet configuration_SCAM; Supplier 1: Digi-Key; RoHS: Yes; Stock 1: 2750454; Pricing 1: 1 = 0.10000, 10 = 0.05400, 100 = 0.02190, 1000 = 0.00985, 2500 = 0.00855 (USD); Mount: Surface Mount; Case/Package: 0603; Weight: 7.1E-05oz; Case Code (Metric): 1608; Case Code (Imperial): 0603; Contact Plating: Tin; Min Operating Temperature: -55°C; Max Operating Temperature: 155°C; Tolerance: 5%; Packaging: Tape and Reel; Package Quantity: 1; Composition: Thick Film; Number of Terminations: 2; Termination: SMD/SMT; Military Standard: Not; Max Power Dissipation: 100mW; Features: Automotive AEC-Q200; Length: 1.6mm; Height: 0.45mm; Width: 0.031inch; Depth: 0.8mm; Radiation Hardening: No; REACH SVHC: No SVHC; Lead Free: Lead Free; ComponentLink1URL: https://datasheet.ciiva.com/34303/1988727-34303616.pdf?src-supplier=Jameco; ComponentLink1Description: https://datasheet.ciiva.com/34303/1988727-34303616.pdf?src-supplier=Jameco; ComponentLink2URL: https://datasheet.ciiva.com/11821/0900766b80f806dd-11821444.pdf?src-supplier=RSComponents; ComponentLink2Description: https://datasheet.ciiva.com/11821/0900766b80f806dd-11821444.pdf?src-supplier=RSComponents; ComponentLink3URL: https://datasheet.ciiva.com/9117/aoa0000ce1-9117173.pdf?src-supplier=Avnet; ComponentLink3Description: https://datasheet.ciiva.com/9117/aoa0000ce1-9117173.pdf?src-supplier=Avnet; ComponentLink4URL: https://datasheet.ciiva.com/16767/70255313-16767749.pdf?src-supplier=Allied+Electronics; ComponentLink4Description: https://datasheet.ciiva.com/16767/70255313-16767749.pdf?src-supplier=Allied+Electronics; ComponentLink5URL: https://datasheet.ciiva.com/15159/getdatasheetpartid-29203-15159270.pdf?src-supplier=Verical; ComponentLink5Description: https://datasheet.ciiva.com/15159/getdatasheetpartid-29203-15159270.pdf?src-supplier=Verical; ComponentLink6URL: https://datasheet.ciiva.com/28673/1678796-28673994.pdf?src-supplier=Element14; ComponentLink6Description: https://datasheet.ciiva.com/28673/1678796-28673994.pdf?src-supplier=Element14; ComponentLink7URL: https://datasheet.ciiva.com/6138/1500035-6138716.pdf?src-supplier=Farnell; ComponentLink7Description: https://datasheet.ciiva.com/6138/1500035-6138716.pdf?src-supplier=Farnell; ComponentLink8URL: https://datasheet.ciiva.com/46381/1500035-46381164.pdf?src-supplier=Element14; ComponentLink8Description: https://datasheet.ciiva.com/46381/1500035-46381164.pdf?src-supplier=Element14; ComponentLink9URL: https://datasheet.ciiva.com/16449/aoa0000ce1-16449005.pdf?src-supplier=Future+Electronics; ComponentLink9Description: https://datasheet.ciiva.com/16449/aoa0000ce1-16449005.pdf?src-supplier=Future+Electronics; Supplier Part Number 1: P330GCT-ND
R4 R5 = RES_47R_0.25W_0805: as R29 on sheet configuration_SCAM; Supplier 1: Digi-Key; RoHS: RoHS Compliant; Category: Resistors; Stock 1: 17932; Pricing 1: 1=0.11, 10=0.098, 100=0.0378, 1000=0.01664, 2500=0.01437 (USD); Packaging: Cut Tape (CT); Part Status: Active; Tolerance: ±5%; Power (Watts): 0.4W; Composition: Thick Film; Features: Automotive AEC-Q200, Pulse Withstanding; Operating Temperature: -55°C ~ 155°C; Package / Case: 0805 (2012 Metric); Supplier Device Package: 0805; Size / Dimension: 0.079" L x 0.049" W (2.00mm x 1.25mm); Height - Seated (Max): 0.026" (0.65mm); Failure Rate: -; ComponentLink1URL: http://www.rohm.com/web/global/datasheet/ESR01MZPF/esr-e; ComponentLink1Description: http://www.rohm.com/web/global/datasheet/ESR01MZPF/esr-e; Supplier Part Number 1: RHM47KCT-ND
U1 = XC6SLX9-L1TQG144I: as U1 on sheet configuration_SCAM; Published: 17-Nov-2009; DatasheetVersion: ver1.6, Nov-2010; PackageVersion: ver1.2, Jun-2004; PackageReference: TQG144; Publisher: Altium Limited; PackageDescription: 144-Pin Thin Quad Flat Pack (TQG144) - Pb-Free; Code_JEDEC: MS-026-BFB; ComponentLink1Description: Manufacturer Link; ComponentLink1URL: http://www.xilinx.com; ComponentLink2Description: Spartan-6 Datasheet; ComponentLink2URL: http://www.xilinx.com/support/documentation/data_sheets/ds160.pdf; ComponentLink3Description: Spartan-6 Documents; ComponentLink3URL: http://www.xilinx.com/support/documentation/spartan-6.htm; ComponentLink4Description: Xilinx.com Home; ComponentLink4URL: http://www.xilinx.com; Supplier 1: Digi-Key; Supplier Part Number 1: 122-1779-ND
U2 = TLV1117LV12DCYR: Linear Voltage Regulator IC Positive Fixed 1 Output 1.2V 1A SOT-223-4; Manufacturer: Texas Instruments; Number of Outputs: 1; Max Power Dissipation: 1.59W; Dropout Voltage: 570mV; Max Input Voltage: 5.5V; Min Input Voltage: 2V; Min Current Limit: 1.1A; Quiescent Current: 50uA; Accuracy: 2%; Supplier 1: Digi-Key; Manufacturer Part Number: TLV1117LV12DCYR; RoHS: Yes; Category: Voltage Regulators - Linear; Pricing 1: 1=0.49000, 10=0.41700, 25=0.38960, 100=0.31160, 250=0.28936, 500=0.24486, 1000=0.18921 (USD); Case/Package: SOT-223; Number of Pins: 4; Contact Plating: Tin; Min Operating Temperature: -40°C; Max Operating Temperature: 125°C; Output Voltage: 1.2V; Packaging: Tape and Reel; Output Current: 1A; Package Quantity: 1; Max Output Current: 1A; Number of Regulators: 1; Polarity: Positive; Power Dissipation: 1.59W; Nominal Output Voltage: 1.2V; Power Rating: 1.59W; Min Output Voltage: 1.2V; Max Output Voltage: 1.2V; Output Type: Fixed; Series: -; Length: 6.7mm; Width: 3.7mm; Height: 1.7mm; Radiation Hardening: No; REACH SVHC: No SVHC; Lead Free: Lead Free; RoHS Compliant: Yes; ComponentLink1URL: http://components.arrow.com/part/dataview/51117909S8954704N7713?src-supplier=Arrow+Electronics; ComponentLink1Description: http://components.arrow.com/part/dataview/51117909S8954704N7713?src-supplier=Arrow+Electronics; ComponentLink2URL: http://www.ti.com/general/docs/lit/getliterature.tsp?genericPartNumber=TLV1117LV&amp;&amp;fileType=pdf&src-supplier=Farnell; ComponentLink2Description: http://www.ti.com/general/docs/lit/getliterature.tsp?genericPartNumber=TLV1117LV&amp;&amp;fileType=pdf&src-supplier=Farnell; ComponentLink3URL: http://www.ti.com/general/docs/lit/getliterature.tsp?genericPartNumber=TLV1117LV&&fileType=pdf&src-supplier=Element14; ComponentLink3Description: http://www.ti.com/general/docs/lit/getliterature.tsp?genericPartNumber=TLV1117LV&&fileType=pdf&src-supplier=Element14; ComponentLink4URL: http://www.ti.com/general/docs/lit/getliterature.tsp?genericPartNumber=TLV1117LV&&fileType=pdf&src-supplier=Farnell; ComponentLink4Description: http://www.ti.com/general/docs/lit/getliterature.tsp?genericPartNumber=TLV1117LV&&fileType=pdf&src-supplier=Farnell; ComponentLink5URL: http://www.ti.com/lit/ds/symlink/tlv1117lv.pdf?src-supplier=Digi-Key; ComponentLink5Description: http://www.ti.com/lit/ds/symlink/tlv1117lv.pdf?src-supplier=Digi-Key; ComponentLink6URL: http://www.ti.com/general/docs/lit/getliterature.tsp?genericPartNumber=TLV1117LV&amp;&amp;fileType=pdf&src-supplier=Newark; ComponentLink6Description: http://www.ti.com/general/docs/lit/getliterature.tsp?genericPartNumber=TLV1117LV&amp;&amp;fileType=pdf&src-supplier=Newark; ComponentLink7URL: http://www.farnell.com/datasheets/1888875.pdf?src-supplier=Newark; ComponentLink7Description: http://www.farnell.com/datasheets/1888875.pdf?src-supplier=Newark; ComponentLink8URL: http://www.ti.com/lit/gpn/tlv1117lv?src-supplier=Mouser; ComponentLink8Description: http://www.ti.com/lit/gpn/tlv1117lv?src-supplier=Mouser; ComponentLink9URL: http://www.ti.com/general/docs/lit/getliterature.tsp?genericPartNumber=TLV1117LV&&fileType=pdf&src-supplier=Avnet; ComponentLink9Description: http://www.ti.com/general/docs/lit/getliterature.tsp?genericPartNumber=TLV1117LV&&fileType=pdf&src-supplier=Avnet; Supplier Part Number 1: 296-28776-1-ND
U3 = TLV1117LV18: 1A Low-Dropout Linear Regulator, 4-pin SOT-223; Manufacturer: Texas Instruments; Manufacturer Part Number: TLV1117LV18DCYR; Regulator Topology: Positive Fixed; Voltage - Output: 1.8V; Voltage - Dropout (Typical): 0.57V @ 1A; Number of Regulators: 1; Voltage - Input: Up to 5.5V; Current - Limit (Min): 1.1A; Supplier 1: Digi-Key; RoHS: RoHS Compliant; Category: Integrated Circuits (ICs); Stock 1: 9602; Pricing 1: 1=0.64, 10=0.564, 100=0.4316, 500=0.34196, 1000=0.2739 (USD); Packaging: Digi-Reel®; Part Status: Active; Current - Output: 1A; Operating Temperature: -40°C ~ 125°C; Mounting Type: Surface Mount; Package / Case: TO-261-4, TO-261AA; Supplier Device Package: SOT-223-4; ComponentLink1URL: http://www.ti.com/lit/ds/symlink/tlv1117lv.pdf; ComponentLink1Description: http://www.ti.com/lit/ds/symlink/tlv1117lv.pdf; Supplier Part Number 1: 296-28777-6-ND